# Altium project Lab1.PrjPcb
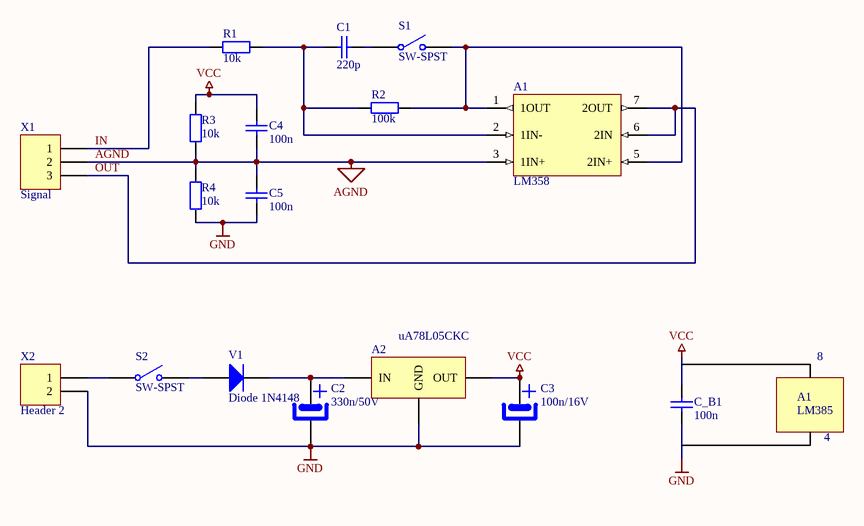
[diagram p0: Labos1_2013.SchDoc]
1 sheet, 17 parts. Net scope: global (net labels, ports and power ports of the same name join across sheets).

## Sheet Labos1_2013.SchDoc
size A4

### Parts
A1  LM358  [DIP-8]
A2  uA78L05CKC  [KC-03]
C1  220p  [RAD-0.1]
C2  330n/50V  [CAPPR2-5x6.8]
C3  100n/16V  [CAPPR2-5x6.8]
C4  100n  [RAD-0.1]
C5  100n  [RAD-0.1]
C_B1  100n  [RAD-0.1]
R1  10k  [AXIAL-0.4]
R2  100k  [AXIAL-0.4]
R3  10k  [AXIAL-0.4]
R4  10k  [AXIAL-0.4]
S1  SW-SPST  [Toggle]
S2  SW-SPST  [Toggle]
V1  Diode 1N4148  [DO-35]
X1  Signal  [HDR1X3]
X2  Header 2  [BAT-2]

### Nets
AGND: A1.3(1IN+) C4.1 C5.2 R3.1 R4.2 X1.2
GND: A1.4(GND) A2.17(GND) C2.2 C3.2 C5.1 C_B1.1 R4.1 X2.2
VCC: A2.16(OUT) C3.1 C4.2 C_B1.2 R3.2
IN: R1.1 X1.1
OUT: A1.6(2IN) A1.7(2OUT) X1.3
NetA1_1: A1.1(1OUT) A1.5(2IN+) R2.2 S1.2(NO)
NetA1_2: A1.2(1IN-) C1.1 R1.2 R2.1
NetA2_15: A2.15(IN) C2.1 V1.2(K)
NetC1_2: C1.2 S1.1(COMMON)
NetS2_1: S2.1(COMMON) X2.1
NetS2_2: S2.2(NO) V1.1(A)

Not connected (* = marked no-connect by the designer): A1 8(VCC)

### Notes on the sheet
- 8
- A1
- LM385
- 4

### Library data of the parts
A1 = LM358: Cijena [Kn]: 2,86; Dobavljaè: Farnell; Kat. broj: 1459520; Tip: OpAmp LM358
A2 = uA78L05CKC: Cijena [Kn]: 3,84; Dobavljaè: Farnell; Kat. broj: 1575574; Tip: UA7805CKCS
C1 = Cap: Capacitor; Cijena [Kn]: 0,24; Dobavljaè: Farnell; Kat. broj: 1694233; Tip: 220pF
C2 = Elko: Cijena [Kn]: 0,33; Dobavljaè: Farnell; Kat. broj: 1902922; Tip: 330n/50V
C3 = Elko: Cijena [Kn]: 0,33; Dobavljaè: Farnell; Kat. broj: 1902919; Tip: 100n/50V
C4 C5 C_B1 = Cap: Capacitor; Cijena [Kn]: 0,26; Dobavljaè: Farnell; Kat. broj: 1694101; Tip: 100n
R1 R3 R4 = Res2: Resistor; Cijena [Kn]: 0,07; Dobavljaè: Farnell; Kat. broj: 1127905; Tip: 10k
R2 = Res2: Resistor; Cijena [Kn]: 0,05; Dobavljaè: Farnell; Kat. broj: 1127978; Tip: 100k
S1 S2 = SW-SPST: Single-Pole, Single-Throw Switch; Cijena [Kn]: 28,89; Dobavljaè: Farnell; Kat. broj: 1357683; Tip: Sklopka M2015SS1W01
V1 = Diode 1N4148: High Conductance Fast Diode; Cijena [Kn]: 0,32; Dobavljaè: Farnell; Kat. broj: 9843680; Tip: 1N4148
X1 = Header 3: Header, 3-Pin; Cijena [Kn]: 3,94; Dobavljaè: Farnell; Kat. broj: 1925631; Tip: 3-pinski konektor
X2 = Header 2: Header, 2-Pin; Cijena [Kn]: 3,40; Dobavljaè: Farnell; Kat. broj: 2254692; Tip: 2-pinski konektor